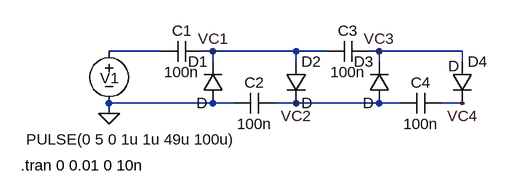
[diagram p0: schematic VoltageMultiplier.asc]
VoltageMultiplier.asc, the LTspice schematic file:
Version 4
SHEET 1 880 680
WIRE 128 128 48 128
WIRE 208 128 192 128
WIRE 336 128 208 128
WIRE 384 128 336 128
WIRE 464 128 448 128
WIRE 592 128 464 128
WIRE 208 144 208 128
WIRE 336 144 336 128
WIRE 464 144 464 128
WIRE 592 144 592 128
WIRE 208 208 48 208
WIRE 240 208 208 208
WIRE 336 208 304 208
WIRE 464 208 336 208
WIRE 496 208 464 208
WIRE 592 208 560 208
WIRE 48 224 48 208
FLAG 48 224 0
FLAG 208 128 VC1
FLAG 464 128 VC3
FLAG 336 208 VC2
FLAG 592 208 VC4
SYMBOL voltage 48 112 R0
WINDOW 0 -14 57 Left 2
WINDOW 3 -128 152 Left 2
WINDOW 123 0 0 Left 0
WINDOW 39 0 0 Left 0
SYMATTR InstName V1
SYMATTR Value PULSE(0 5 0 1u 1u 49u 100u)
SYMBOL cap 192 112 R90
WINDOW 0 0 32 VBottom 2
WINDOW 3 32 32 VTop 2
SYMATTR InstName C1
SYMATTR Value 100n
SYMBOL cap 304 192 R90
WINDOW 0 0 32 VBottom 2
WINDOW 3 32 32 VTop 2
SYMATTR InstName C2
SYMATTR Value 100n
SYMBOL diode 224 208 R180
WINDOW 0 24 64 Left 2
WINDOW 3 24 0 Left 2
SYMATTR InstName D1
SYMBOL diode 320 144 R0
SYMATTR InstName D2
SYMBOL cap 448 112 R90
WINDOW 0 0 32 VBottom 2
WINDOW 3 32 32 VTop 2
SYMATTR InstName C3
SYMATTR Value 100n
SYMBOL cap 560 192 R90
WINDOW 0 0 32 VBottom 2
WINDOW 3 32 32 VTop 2
SYMATTR InstName C4
SYMATTR Value 100n
SYMBOL diode 480 208 R180
WINDOW 0 24 64 Left 2
WINDOW 3 24 0 Left 2
SYMATTR InstName D3
SYMBOL diode 576 144 R0
WINDOW 3 -6 7 Left 2
SYMATTR InstName D4
TEXT -88 304 Left 2 !.tran 0 0.01 0 10n

The netlist it stands for:
* VoltageMultiplier.asc
V1 N001 0 PULSE(0 5 0 1u 1u 49u 100u)
C1 VC1 N001 100n
C2 VC2 0 100n
D1 0 VC1 D
D2 VC1 VC2 D
C3 VC3 VC1 100n
C4 VC4 VC2 100n
D3 VC2 VC3 D
D4 VC3 VC4 D
.model D D
.lib standard.dio
.tran 0 0.01 0 10n
.backanno
.end